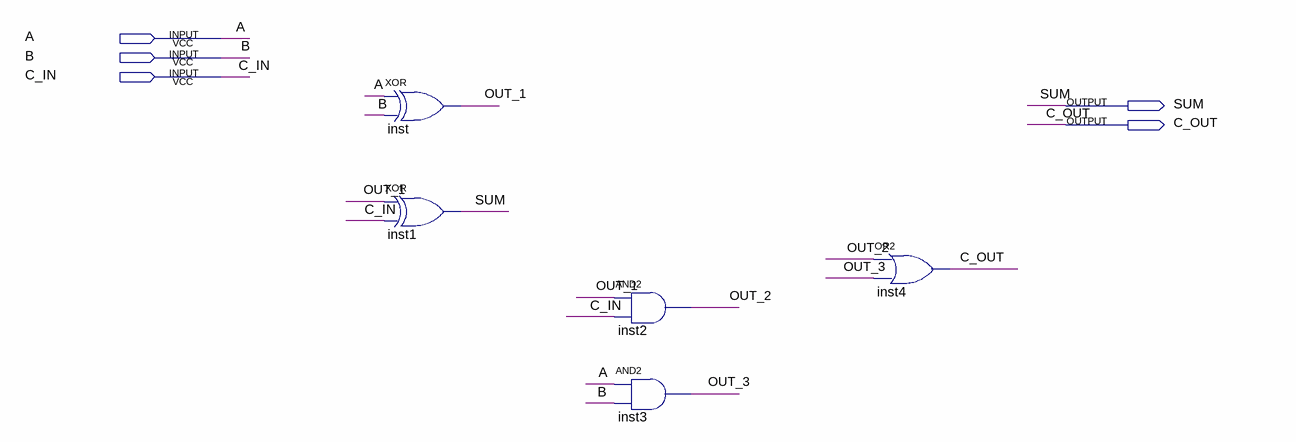
[diagram p0: schematic sheet]
// Quartus schematic FullAdder1Bit.bdf as structural Verilog: 5 symbols, 5 pins
module FullAdder1Bit (
  input  A,
  input  B,
  input  C_IN,
  output SUM,
  output C_OUT
);

  wire OUT_1, OUT_2, OUT_3;

  xor inst (OUT_1, A, B);
  xor inst1 (SUM, OUT_1, C_IN);
  and inst2 (OUT_2, OUT_1, C_IN);
  and inst3 (OUT_3, A, B);
  or inst4 (C_OUT, OUT_2, OUT_3);
endmodule
